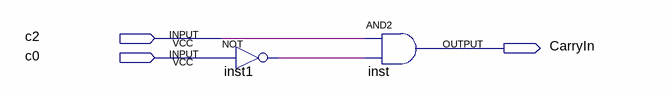
[diagram p0: schematic sheet]
// Quartus schematic analise_CarryIn.bdf as structural Verilog: 2 symbols, 3 pins
module analise_CarryIn (
  input  c2,
  input  c0,
  output CarryIn
);

  wire inst1_out;

  not inst1 (inst1_out, c0);
  and inst (CarryIn, c2, inst1_out);
endmodule
